# Altium schematic sheet FrameBuffer.SchDoc
size A4; DocumentNumber: 4; SheetNumber: 4; SheetTotal: 10
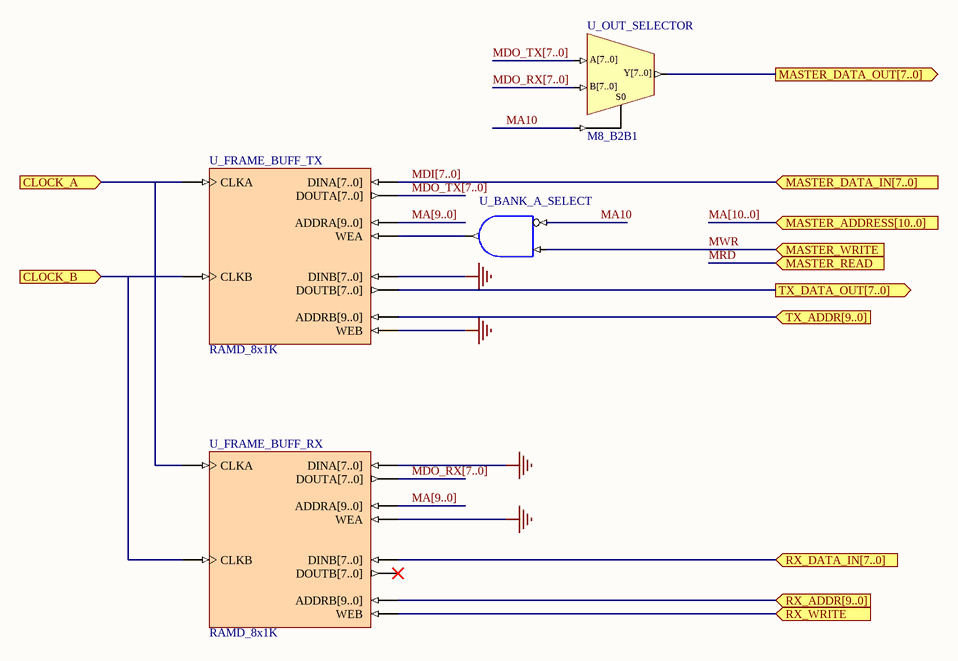
[diagram p0: FrameBuffer.SchDoc]

## Parts
U_BANK_A_SELECT  AND2N1S  (value not drawn)
U_FRAME_BUFF_RX  RAMD_8x1K
U_FRAME_BUFF_TX  RAMD_8x1K
U_OUT_SELECTOR  M8_B2B1

## Ports
CLOCK_A (in), CLOCK_B (in), MASTER_ADDRESS[10..0] (in), MASTER_DATA_IN[7..0] (in), MASTER_DATA_OUT[7..0] (out), MASTER_READ (in), MASTER_WRITE (in), RX_ADDR[9..0] (in), RX_DATA_IN[7..0] (in), RX_WRITE (in), TX_ADDR[9..0] (in), TX_DATA_OUT[7..0] (out)

## Nets
GND: U_FRAME_BUFF_RX.WEA U_FRAME_BUFF_TX.WEB
GNDBUS[..]: U_FRAME_BUFF_RX.DINA[7..0] U_FRAME_BUFF_TX.DINB[7..0]
CLOCK_A: U_FRAME_BUFF_RX.CLKA U_FRAME_BUFF_TX.CLKA ; port CLOCK_A
CLOCK_B: U_FRAME_BUFF_RX.CLKB U_FRAME_BUFF_TX.CLKB ; port CLOCK_B
MA10: U_BANK_A_SELECT.I0 U_OUT_SELECTOR.S0
MA[9..0]: U_FRAME_BUFF_RX.ADDRA[9..0] U_FRAME_BUFF_TX.ADDRA[9..0]
MASTER_DATA_OUT[7..0]: U_OUT_SELECTOR.Y[7..0] ; port MASTER_DATA_OUT[7..0]
MDI[7..0]: U_FRAME_BUFF_TX.DINA[7..0] ; port MASTER_DATA_IN[7..0]
MDO_RX[7..0]: U_FRAME_BUFF_RX.DOUTA[7..0] U_OUT_SELECTOR.B[7..0]
MDO_TX[7..0]: U_FRAME_BUFF_TX.DOUTA[7..0] U_OUT_SELECTOR.A[7..0]
MRD: port MASTER_READ
MWR: U_BANK_A_SELECT.I1 ; port MASTER_WRITE
RX_ADDR[9..0]: U_FRAME_BUFF_RX.ADDRB[9..0] ; port RX_ADDR[9..0]
RX_DATA_IN[7..0]: U_FRAME_BUFF_RX.DINB[7..0] ; port RX_DATA_IN[7..0]
RX_WRITE: U_FRAME_BUFF_RX.WEB ; port RX_WRITE
TX_ADDR[9..0]: U_FRAME_BUFF_TX.ADDRB[9..0] ; port TX_ADDR[9..0]
TX_DATA_OUT[7..0]: U_FRAME_BUFF_TX.DOUTB[7..0] ; port TX_DATA_OUT[7..0]
NetU_BANK_A_SELECT_O: U_BANK_A_SELECT.O U_FRAME_BUFF_TX.WEA

Not connected (* = marked no-connect by the designer): U_FRAME_BUFF_RX DOUTB[7..0]*

## Buses and harness runs
bus MA[9..0]
bus MA[10..0] = port MASTER_ADDRESS[10..0]
bus MDI[7..0] = port MASTER_DATA_IN[7..0]
bus MDO_RX[7..0]
bus MDO_TX[7..0]

## Library data of the parts
U_BANK_A_SELECT = AND2N1S: 2-Input AND Gate with Active Low A Input, Single Pin Version; Xilinx Equivalent: AND2B1; ArchiveName: GENERIC; VHDLIB_SIM: GENERIC_LIB; Published: 29-Jan-2004; Publisher: Altium Limited; Core Revision: 1.00.00
U_FRAME_BUFF_RX U_FRAME_BUFF_TX = RAMD_8x1K: Dual Port Random Access Memory; Memory_DepthA: 1024; Memory_Type: RAM_DualPortBlock; Memory_WidthA: 8; Memory_ClockEdge: Rising; Nexus_Core: Memory_Program; Memory_EnablePin: False; Published: 13/01/2004; Publisher: Altium Hobart Technology Center; Memory_DepthB: 1024; Memory_WidthB: 8
U_OUT_SELECTOR = M8_B2B1: 2x8-Bit Bus to 1x8-Bit Bus Multiplexer; ArchiveName: GENERIC; VHDLIB_SIM: GENERIC_LIB; Published: 29-Jan-2004; Publisher: Altium Limited; Core Revision: 1.00.00